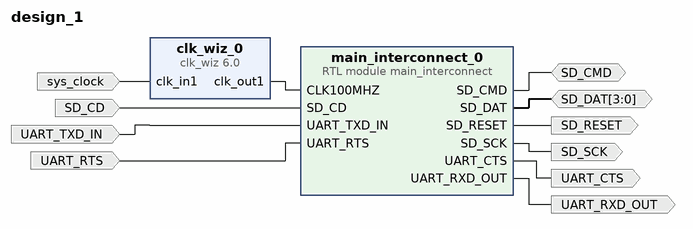
[diagram p0: block diagram of the top level]
# Vivado block design design_1, xc7a100tcsg324-1, Vivado 2019.1.3
create_bd_design design_1

create_bd_port -dir IO SD_CMD
create_bd_port -dir O SD_SCK
create_bd_port -dir O -type rst SD_RESET
create_bd_port -dir O UART_CTS
create_bd_port -dir O UART_RXD_OUT
create_bd_port -dir I -type clk sys_clock
set_property -dict {CONFIG.FREQ_HZ 100000000 CONFIG.PHASE 0.000} [get_bd_ports sys_clock]
create_bd_port -dir I SD_CD
create_bd_port -dir IO -from 3 -to 0 SD_DAT
create_bd_port -dir I UART_TXD_IN
create_bd_port -dir I UART_RTS

create_bd_cell -type module -reference main_interconnect main_interconnect_0
create_bd_cell -type ip -vlnv xilinx.com:ip:clk_wiz:6.0 clk_wiz_0
set_property -dict {CONFIG.CLK_IN1_BOARD_INTERFACE sys_clock CONFIG.USE_BOARD_FLOW true} [get_bd_cells clk_wiz_0]

# ---- connections ----

connect_bd_net [get_bd_ports SD_CMD] [get_bd_pins main_interconnect_0/SD_CMD]
connect_bd_net [get_bd_pins main_interconnect_0/SD_SCK] [get_bd_ports SD_SCK]
connect_bd_net [get_bd_pins main_interconnect_0/SD_RESET] [get_bd_ports SD_RESET]
connect_bd_net [get_bd_pins main_interconnect_0/UART_CTS] [get_bd_ports UART_CTS]
connect_bd_net [get_bd_pins main_interconnect_0/UART_RXD_OUT] [get_bd_ports UART_RXD_OUT]
connect_bd_net [get_bd_ports sys_clock] [get_bd_pins clk_wiz_0/clk_in1]
connect_bd_net [get_bd_pins clk_wiz_0/clk_out1] [get_bd_pins main_interconnect_0/CLK100MHZ]
connect_bd_net -net SD_CD_0_1 [get_bd_ports SD_CD] [get_bd_pins main_interconnect_0/SD_CD]
connect_bd_net [get_bd_ports SD_DAT] [get_bd_pins main_interconnect_0/SD_DAT]
connect_bd_net -net UART_TXD_IN_0_1 [get_bd_ports UART_TXD_IN] [get_bd_pins main_interconnect_0/UART_TXD_IN]
connect_bd_net -net UART_RTS_0_1 [get_bd_ports UART_RTS] [get_bd_pins main_interconnect_0/UART_RTS]

validate_bd_design
save_bd_design
